# Altium schematic sheet SCH_1.SchDoc
size A; SheetNumber: 1; SheetTotal: 1
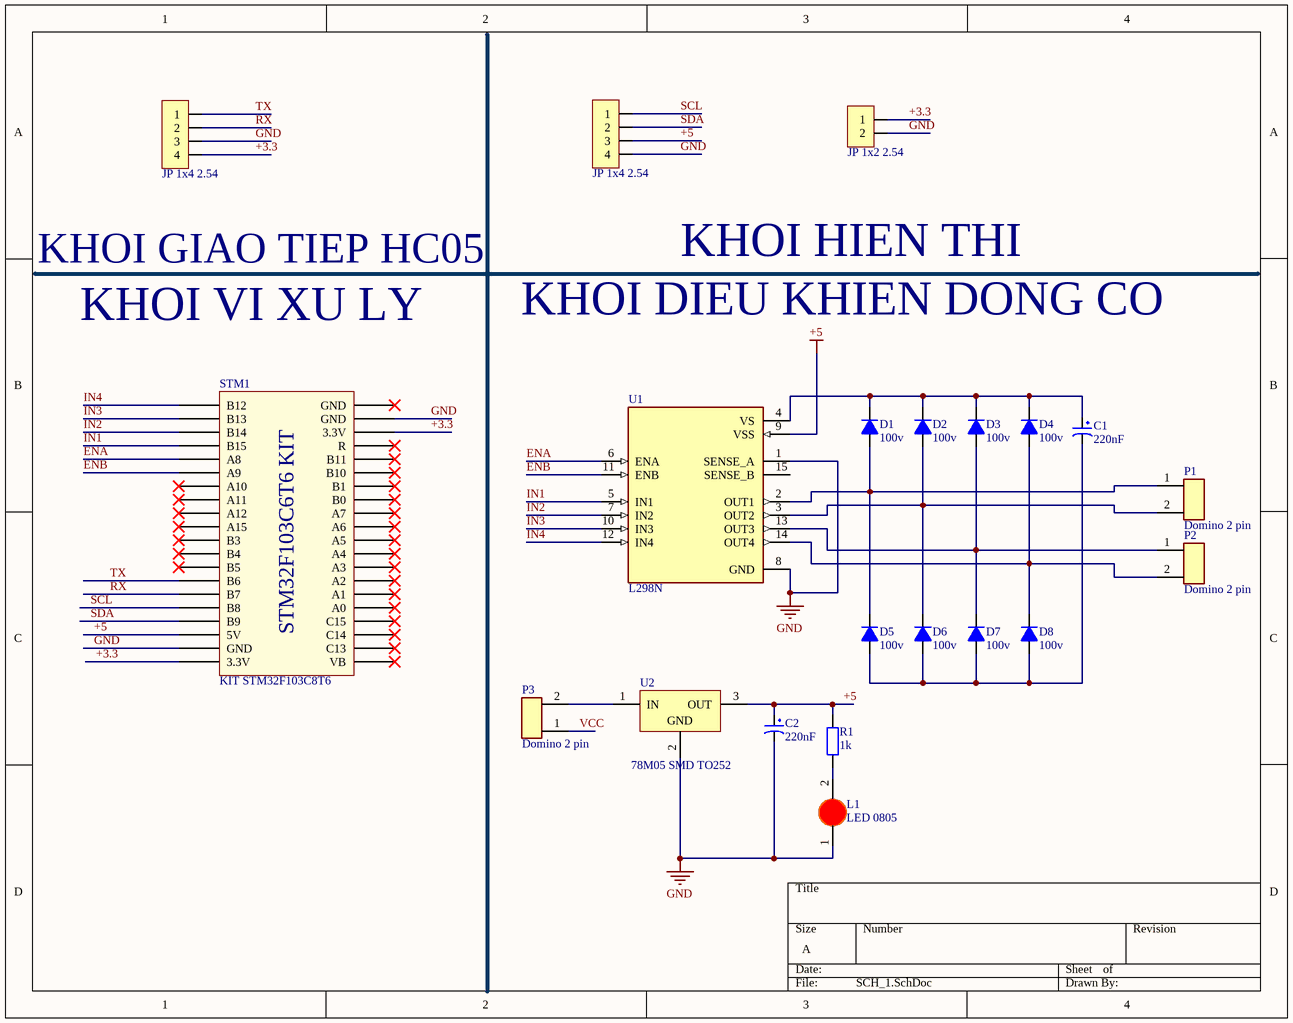
[diagram p0: SCH_1.SchDoc]

## Parts
C1  220nF  [tu hoa 8mm]
C2  220nF  [tu hoa 8mm]
D1  100v  [DIODE 1A]
D2  100v  [DIODE 1A]
D3  100v  [DIODE 1A]
D4  100v  [DIODE 1A]
D5  100v  [DIODE 1A]
D6  100v  [DIODE 1A]
D7  100v  [DIODE 1A]
D8  100v  [DIODE 1A]
JP1  JP 1x4 2.54  [JP 1x4 CT]
JP2  JP 1x4 2.54  [JP 1x4 CC]
JP3  JP 1x2 2.54  [JP 1x2 DC]
L1  LED 0805  [LED-0805-Red]
P1  Domino 2 pin  [Domino_2pin_5.08mm]
P2  Domino 2 pin  [Domino_2pin_5.08mm]
P3  Domino 2 pin  [Domino_2pin_5.08mm]
R1  1k  [tro smd 0805]
STM1  KIT STM32F103C8T6  [STM32F103 KIT]
U1  L298N  [L298N]
U2  78M05 SMD TO252  [TO252]

## Nets
+5: C2.1 JP2.3 R1.2 STM1.18(5V) U1.9(VSS) U2.3(OUT)
GND: C2.2 JP1.3 JP2.4 JP3.2 L1.1(A) STM1.19(GND) STM1.39(GND) U1.1(SENSE_A) U1.8(GND) U2.2(GND)
+3.3: JP1.4 JP3.1 STM1.20(3.3V) STM1.38(3.3V)
ENA: STM1.5(A8) U1.6(ENA)
ENB: STM1.6(A9) U1.11(ENB)
IN1: STM1.4(B15) U1.5(IN1)
IN2: STM1.3(B14) U1.7(IN2)
IN3: STM1.2(B13) U1.10(IN3)
IN4: STM1.1(B12) U1.12(IN4)
RX: JP1.2 STM1.15(B7)
SCL: JP2.1 STM1.16(B8)
SDA: JP2.2 STM1.17(B9)
TX: JP1.1 STM1.14(B6)
VCC: P3.1
NetC1_1: C1.1 D1.2(K) D2.2(K) D3.2(K) D4.2(K) U1.4(VS)
NetC1_2: C1.2 D5.1(A) D6.1(A) D7.1(A) D8.1(A)
NetD1_1: D1.1(A) D5.2(K) P1.1 U1.2(OUT1)
NetD2_1: D2.1(A) D6.2(K) P1.2 U1.3(OUT2)
NetD3_1: D3.1(A) D7.2(K) P2.1 U1.13(OUT3)
NetD4_1: D4.1(A) D8.2(K) P2.2 U1.14(OUT4)
NetL1_2: L1.2(K) R1.1
NetP3_2: P3.2 U2.1(IN)

Not connected (* = marked no-connect by the designer): STM1 7(A10)* 8(A11)* 9(A12)* 10(A15)* 11(B3)* 12(B4)* 13(B5)* 21(VB)* 22(C13)* 23(C14)* 24(C15)* 25(A0)* 26(A1)* 27(A2)* 28(A3)* 29(A4)* 30(A5)* 31(A6)* 32(A7)* 33(B0)* 34(B1)* 35(B10)* 36(B11)* 37(R)* 40(GND)*; U1 15(SENSE_B)

## Notes on the sheet
- KHOI GIAO TIEP HC05
- KHOI HIEN THI
- KHOI VI XU LY
- KHOI DIEU KHIEN DONG CO
- (in symbol STM32f103 Bluepill) STM32F103C6T6 KIT

## Library data of the parts
C1 C2 = Tu Hoa 220uF 35V 8x12: Cắm; Don_Vi: Con; So_Chan: 2; Ten_Linh_Kien: Tụ Hóa 220uF 35V 8x12MM; Ma_Hang: MH006553; Chung_Loai: Cắm; Kieu_Chan: *
D1-D8 = Diode 1N4007: Cắm; Ten_Linh_Kien: Diode 1N4007 1A (DIP); Don_Vi: Con; Ma_Hang: MH001063; Ghi Chu: *; Kieu_Chan: *; Chung_Loai: Cắm
JP1 = JP 1x4 2.54 Cai Thang: Cắm; Ten_Linh_Kien: Jump Đơn Cái 2.54MM 1x20P Thẳng; Don_Vi: Con; Ma_Hang: MH004006; Ghi_Chu: *; Kieu_Chan: *; Chung_Loai: Cắm
JP2 = JP 1x4 2.54 Cai Cong: Cắm; Ten_Linh_Kien: Jump Đơn Cái 2.54MM 1x40P Cong; Don_Vi: Con; Ma_Hang: MH001265; Ghi_Chu: *; Kieu_Chan: *; Chung_Loai: Cắm
JP3 = JP 1x2 2.54 Duc Cong: Cắm; Ten_Linh_Kien: Jump Đơn Đực 2.54MM 1x40P Cong Đứng; Don_Vi: Con; Ma_Hang: MH000904; Ghi_Chu: *; Kieu_Chan: *; Chung_Loai: Cắm
L1 = LED 0805 Do: Dán; Don_Vi: Con; Ma_Hang: MH000897; Ten_Linh_Kien: LED 0805 Màu Đỏ (Red); Ghi_Chu: *; Kieu_Chan: *; Chung_Loai: Dán
P1-P3 = domino_2pin
R1 = Tro 0805 5% 1k: Dán; Don_Vi: Con; So_Chan: 2; Ten_Linh_Kien: Trở 0805 5% 1k; Ma_Hang: MH005234; Chung_Loai: Dán; Kieu_Chan: *
STM1 = STM32f103 Bluepill: KIT STM32F103C8T6 Bluepill
U1 = L298N: Half Bridge _4_ Driver DC Motors, Relays, Solenoids, Stepper Motors Bipolar 15-Multiwatt; MF: STMicroelectronics; MP: L298N; Package: Multiwatt-15 STMicroelectronics; Price: None; Availability: Unavailable; Value: *; SnapEDA_Link: https://www.snapeda.com/parts/L298N/STMicroelectronics/view-part/294022/?ref=snap
U2 = 78M05 SMD TO252: Dán; Don_Vi: Con; Ten_Linh_Kien: 78M05 TO252; Ma_Hang: MH001917; Ghi_Chu: *; Kieu_Chan: *; Chung_Loai: Dán